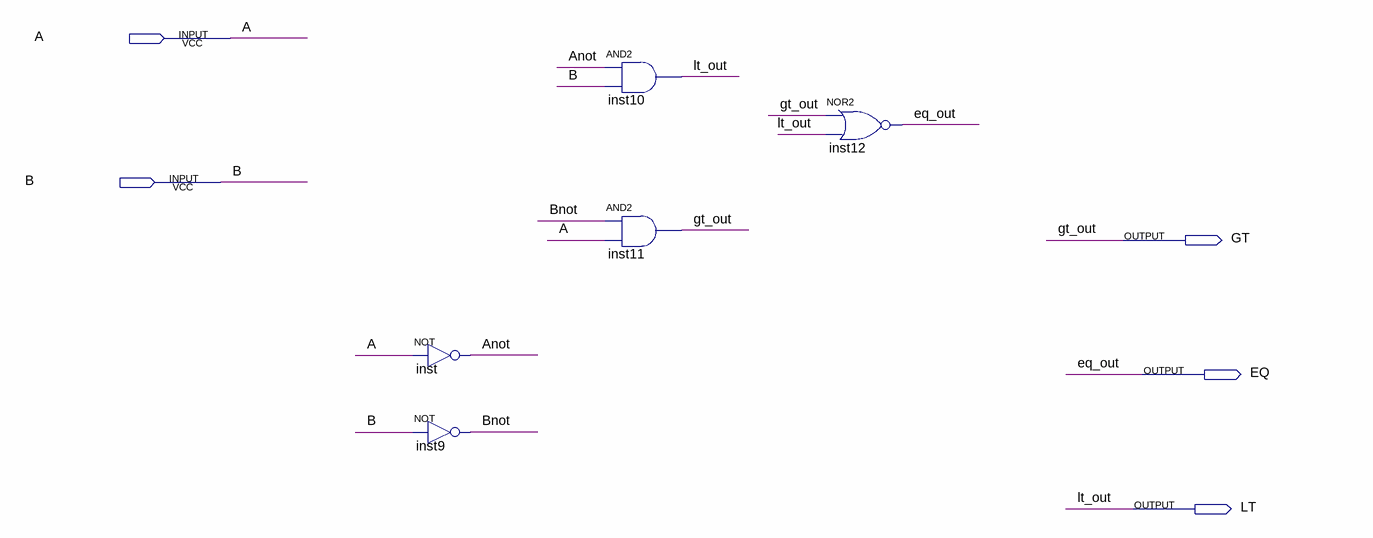
[diagram p0: schematic sheet]
// Quartus schematic cmp_1bit.bdf as structural Verilog: 5 symbols, 5 pins
module cmp_1bit (
  input  A,
  input  B,
  output GT,
  output EQ,
  output LT
);

  wire Anot, Bnot;

  not inst (Anot, A);
  not inst9 (Bnot, B);
  and inst10 (LT, Anot, B);
  and inst11 (GT, Bnot, A);
  nor inst12 (EQ, GT, LT);

  // Other names for the same wires on the sheet: eq_out = EQ; gt_out = GT; lt_out = LT
endmodule
